# Altium schematic sheet esc_outputs.SchDoc: Fault-Tolerant Quadcopter
size A; DrawnBy: Vaughn Kottler; Engineer: Vaughn Kottler; Revision: A
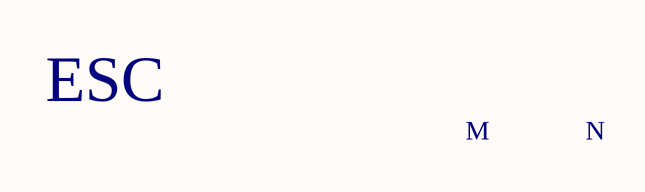
[diagram p0: esc_outputs.SchDoc]

## Notes on the sheet
- ESC
- M
- N